# EAGLE schematic Rev0 (EAGLE 6.5.0)
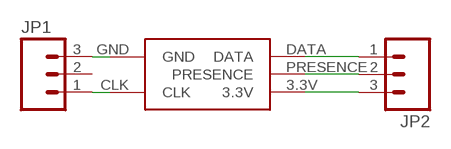
[diagram p0: schematic, sheet 1]

## Parts
JP1  M03PTH  [1X03]
JP2  M03PTH  [1X03]
U$1  NUNCHUCK  [NUNCHUCK-SIMPLE]

## Nets
3.3V: JP2.3 U$1.3.3V
CLK: JP1.1 U$1.CLK
DATA: JP2.1 U$1.DATA
GND: JP1.3 U$1.GND
PRESENCE: JP2.2 U$1.PRESENCE
Unconnected: JP1.2

## Library data of the parts
JP1 JP2 = SparkFun-Connectors:M03: Header 3 Standard 3-pin 0.1" header. Use with straight break away headers (SKU : PRT-00116), right angle break away headers (PRT-00553), swiss pins (PRT-00743), machine pins (PRT-00117), and female headers (PRT-00115). Molex polarized connector foot print use with SKU : PRT-08232 with associated crimp pins and housings.
U$1 = HHJ:NUNCHUCK